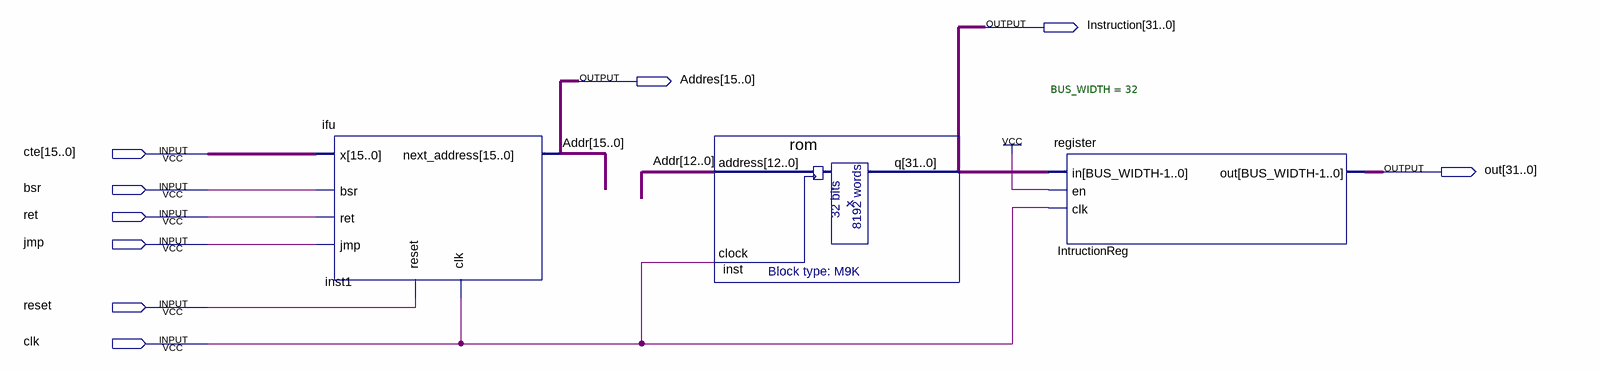
[diagram p0: schematic sheet]
// Quartus schematic program_memory.bdf as structural Verilog: 3 symbols, 9 pins
module program_memory (
  input  [15:0] cte,
  input  bsr,
  input  ret,
  input  jmp,
  input  reset,
  input  clk,
  output [31:0] Instruction,
  output [15:0] Addres,
  output [31:0] out
);

  ifu inst1 (.x(cte), .clk(clk), .bsr(bsr), .jmp(jmp), .ret(ret), .reset(reset), .next_address(Addres));
  rom inst (.address(Addres[12:0]), .clock(clk), .q(Instruction));
  register #(.BUS_WIDTH(32)) IntructionReg (.in(Instruction), .en(1'b1), .clk(clk), .out(out));

  // Other names for the same wires on the sheet: Addr[15:0] = Addres
endmodule
